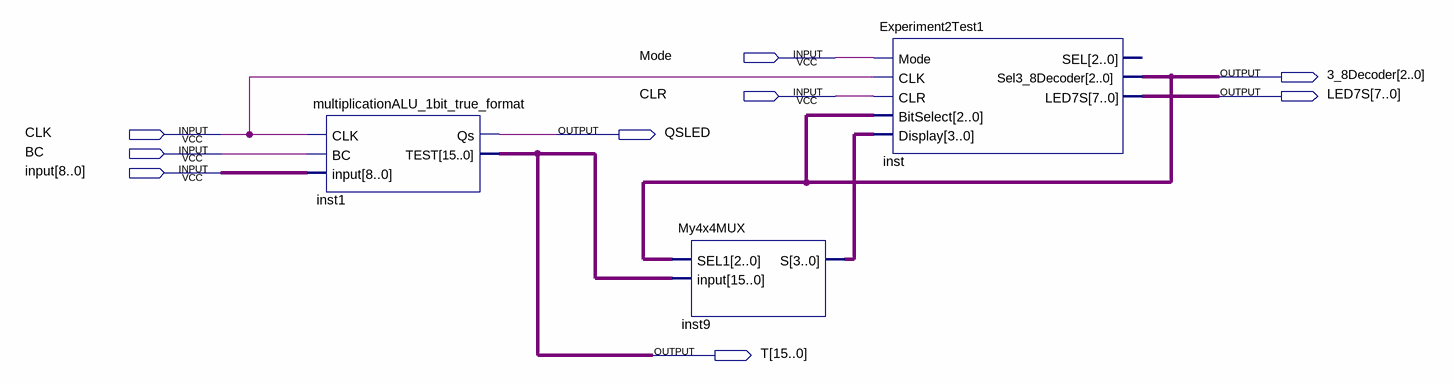
[diagram p0: schematic sheet]
// Quartus schematic TopLevelEntityExp3.bdf as structural Verilog: 3 symbols, 9 pins
module TopLevelEntityExp3 (
  input  Mode,
  input  CLR,
  input  CLK,
  input  BC,
  input  [8:0] \input ,
  output [2:0] \3_8Decoder ,
  output [7:0] LED7S,
  output QSLED,
  output [15:0] T
);

  wire [3:0] inst9_s;

  multiplicationALU_1bit_true_format inst1 (.CLK(CLK), .BC(BC), .\input (\input ), .Qs(QSLED), .TEST(T));
  My4x4MUX inst9 (.SEL1(\3_8Decoder ), .\input (T), .S(inst9_s));
  Experiment2Test1 inst (
    .Mode(Mode), .CLK(CLK), .CLR(CLR), .BitSelect(\3_8Decoder ), .Display(inst9_s),
    .Sel3_8Decoder(\3_8Decoder ), .LED7S(LED7S));  // open: SEL
endmodule
